# EAGLE design novelkey esp (EAGLE 9.2.2)
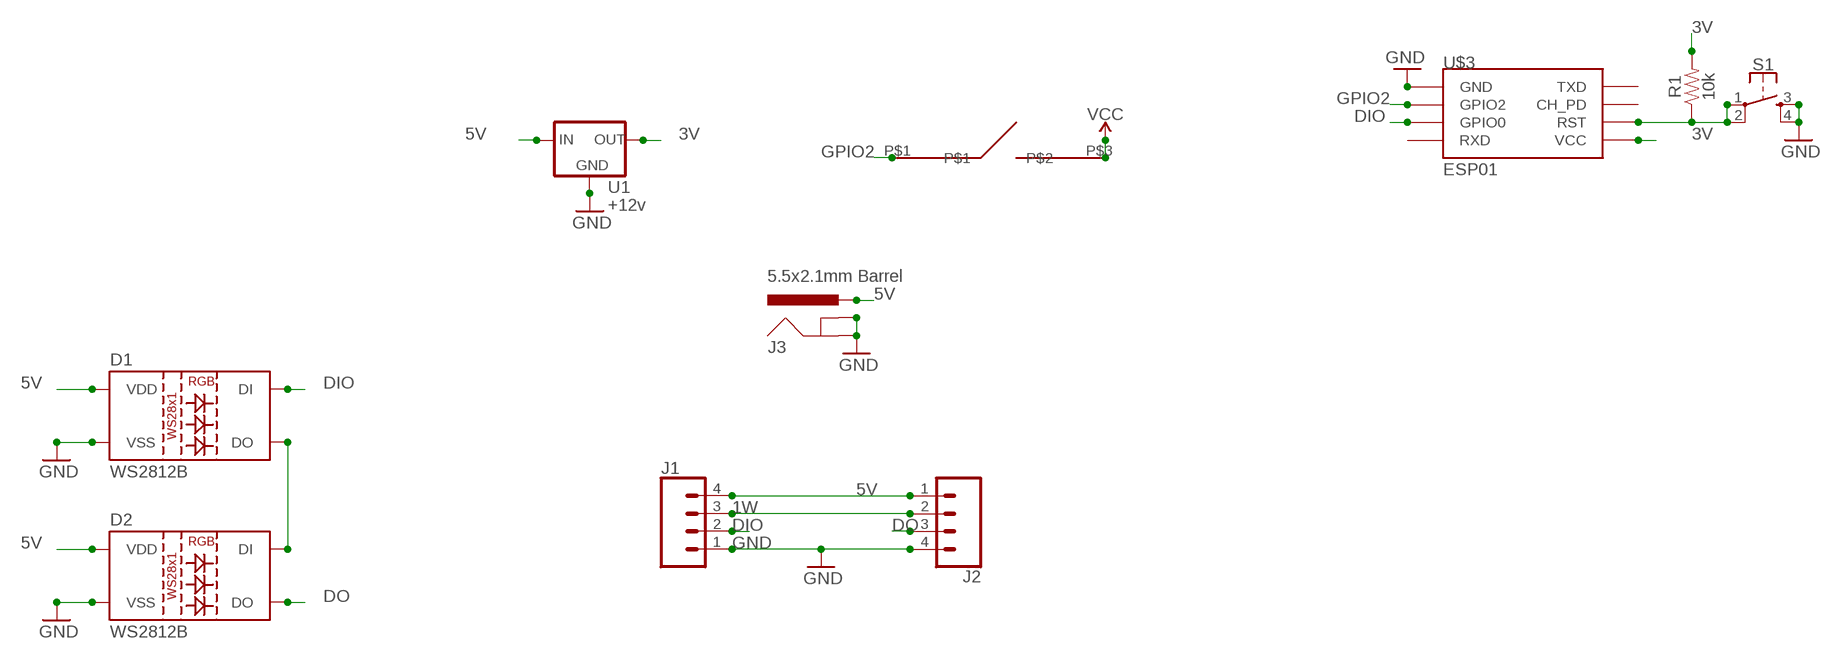
[diagram p0: schematic, sheet 1]

## Parts
D1  WS2812B  [WS2812B]
D2  WS2812B  [WS2812B]
J1  CONN_04SMD2  [1X04_1MM_RA]
J2  CONN_04SMD2  [1X04_1MM_RA]
J3  5.5x2.1mm Barrel  POWER_JACKSMD  [POWER_JACK_SMD]
R1  10k  10KOHM-0603-1/10W-1%  [0603]
S1  MOMENTARY-SWITCH-SPST-2-SMD-4.6X2.8MM  [TACTILE_SWITCH_SMD_4.6X2.8MM]
U1  +12v  V_REG_78XX7812  [TO-252]
U$1  NOVELKEY  [NOVELKEY]
U$3  ESP01  [ESP01]

## Nets
1W: J1.3 J2.2
3V: R1.2 U1.2(OUT) U$3.VCC
5V: D1.1(VDD) D2.1(VDD) J1.4 J2.1 J3.VIN0(PWR) U1.1(IN)
DIO: D1.4(DI) J1.2 U$3.GPIO0
DO: D2.2(DO) J2.3
GND: D1.3(VSS) D2.3(VSS) J1.1 J2.4 J3.GND(GNDBREAK) J3.P$4(GND) S1.3 S1.4 U1.3(GND) U$3.GND
GPIO2: U$1.P$1 U$3.GPIO2
N$1: R1.1 S1.1 S1.2 U$3.RST
N$11: D1.2(DO) D2.4(DI)
VCC: U$1.P$3
Unconnected: U$3.CH_PD U$3.RX(RXD) U$3.TX(TXD)

## Library data of the parts
D1 D2 = SparkFun-LED:WS2812B: WS2812B SMD addressable RGB LED 5x5mm SMD LED with built-in controller IC. Color: Red/Green/Blue mC Rating: RGB: 390, 660, 180 mcd Forward Voltage: RGB: 2.0, 3.0, 3.0 V Packages:WS2812B SparkFun Products: Blynk Board - ESP8266 <https://www.sparkfun.com/products/13794>; PROD_ID: DIO-12503
J1 J2 = SparkFun-Connectors:CONN_04: Multi connection point. Often used as Generic Header-pin footprint for 0.1 inch spaced/style header connections On any of the 0.1 inch spaced packages, you can populate with these: Break Away Headers - Straight <https://www.sparkfun.com/products/116> (PRT-00116) Break Away Male Headers - Right Angle <https://www.sparkfun.com/products/553> (PRT-00553) Female Headers <https://www.sparkfun.com/products/115> (PRT-00115) Break Away Headers - Machine Pin <https://www.sparkfun.com/products/117> (PRT-00117) Break Away Female Headers - Swiss Machine Pin <https://www.sparkfun.com/products/743> (PRT-00743) For SCREWTERMINALS and SPRING TERMINALS visit here: Screw Terimnals on SparkFun.com <https://www.sparkfun.com/search/results?term=Screw+Terminals> (5mm/3.5mm/2.54mm spacing) This device is also useful as a general connection point to wire up your design to another part of your project. Our various solder wires solder well into these plated through hole pads. Hook-Up Wire - Assortment (Stranded, 22 AWG) <https://www.sparkfun.com/products/11375> (PRT-11375) Hook-Up Wire - Assortment (Solid Core, 22 AWG) <https://www.sparkfun.com/products/11367> (PRT-11367) View the entire wire category on our website here <https://www.sparkfun.com/categories/141> Special notes: Molex polarized connector foot print use with SKU : PRT-08231 with associated crimp pins and housings. 1MM SMD Version SKU: PRT-10208; PROD_ID: CONN-10310; SF_ID: PRT-10208
J3 = SparkFun-Connectors:POWER_JACK: Power Jack Connector This is the standard 5.5mm barrel jack for power. The PTH is the most common, proven, reliable, footprint. The Slot footprint only works if the mill layer is transmitted to the PCB fab house so be warned. Here are the connectors we sell at SparkFun: DC Barrel Power Jack/Connector <https://www.sparkfun.com/products/119> (PRT-00119) DC Barrel Power Jack/Connector (SMD) <https://www.sparkfun.com/products/12748> (PRT-12748) DC Barrel Jack Adapter - Breadboard Compatible <https://www.sparkfun.com/products/10811> (PRT-10811) It is used on this SparkFun product (and many, many others): SparkFun RedBoard - Programmed with Arduino <https://www.sparkfun.com/products/12757> (DEV-12757) Also, if you need a mating power supply or connector, please check these out: Wall Adapter Power Supply - 9VDC 650mA <https://www.sparkfun.com/products/298> (TOL-00298) DC Barrel Jack Adapter - Male <https://www.sparkfun.com/products/10287> (PRT-10287); PROD_ID: CONN-08106; SF_ID: PRT-12748
R1 = SparkFun-Resistors:10KOHM: 10kΩ resistor A resistor is a passive two-terminal electrical component that implements electrical resistance as a circuit element. Resistors act to reduce current flow, and, at the same time, act to lower voltage levels within circuits. - Wikipedia; PROD_ID: RES-00824
S1 = SparkFun-Switches:MOMENTARY-SWITCH-SPST-2: Momentary Switch (Pushbutton) - SPST - Two Circuits Normally-open (NO) SPST momentary switches (buttons, pushbuttons). Schematic symbol includes two switch circuits. Variants SMD-4.6MMX2.8MM - 4.60mm x 2.80mm Tactile Momentary Button Switch - Used on SparkFun SAMD21 Mini Breakout <https://www.sparkfun.com/products/13664> SMD-5.2MM - Mini Pushbutton Switch - SMD <https://www.sparkfun.com/products/8720> - Used on Arduino Pro Mini <https://www.sparkfun.com/products/11114>; PROD_ID: SWCH-13065
U1 = SparkFun-IC-Power:V_REG_78XX: Voltage Regulator Standard 78xx regulator. IGO (Input Ground Output). Spark Fun Electronics SKU : COM-00107; PROD_ID: VREG-12370
U$1 = novelkey:NOVELKEY: Novelkey giant MX key
U$3 = esp8266modules:ESP01: ESP8266 Wifi module 01

## Board
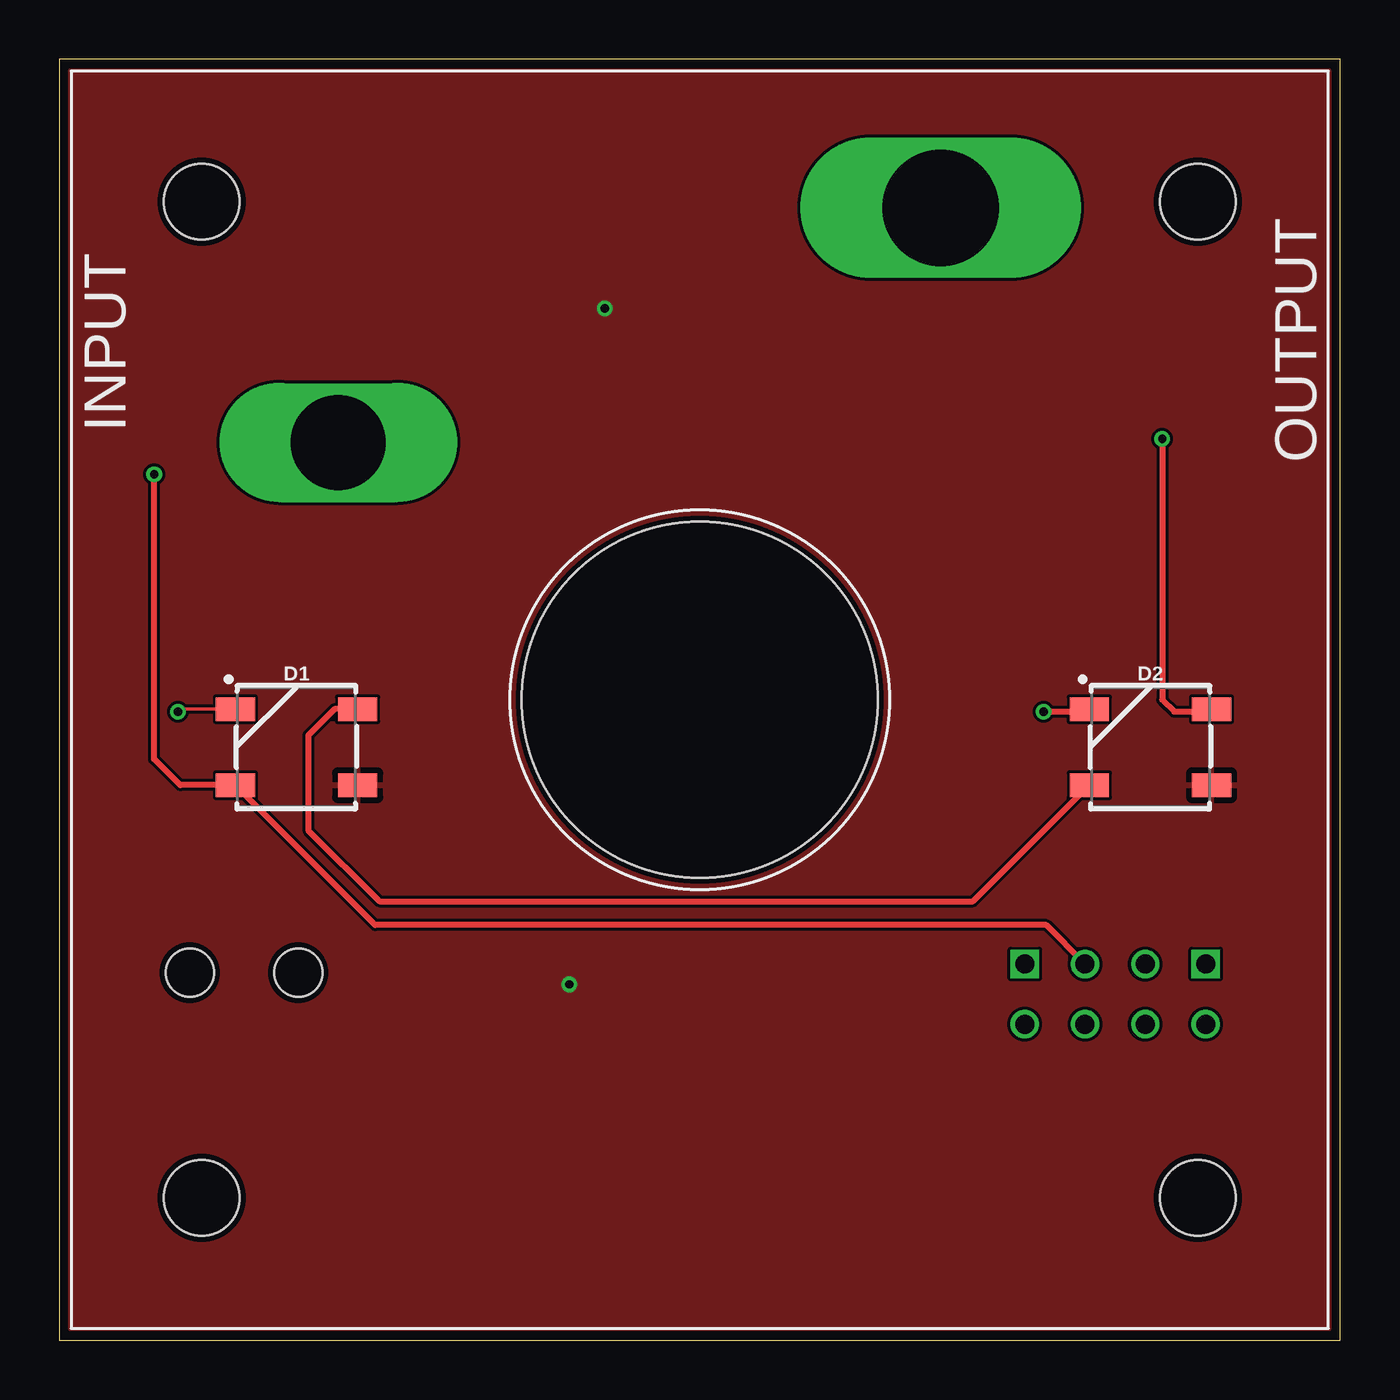
[diagram p1: board, top side]
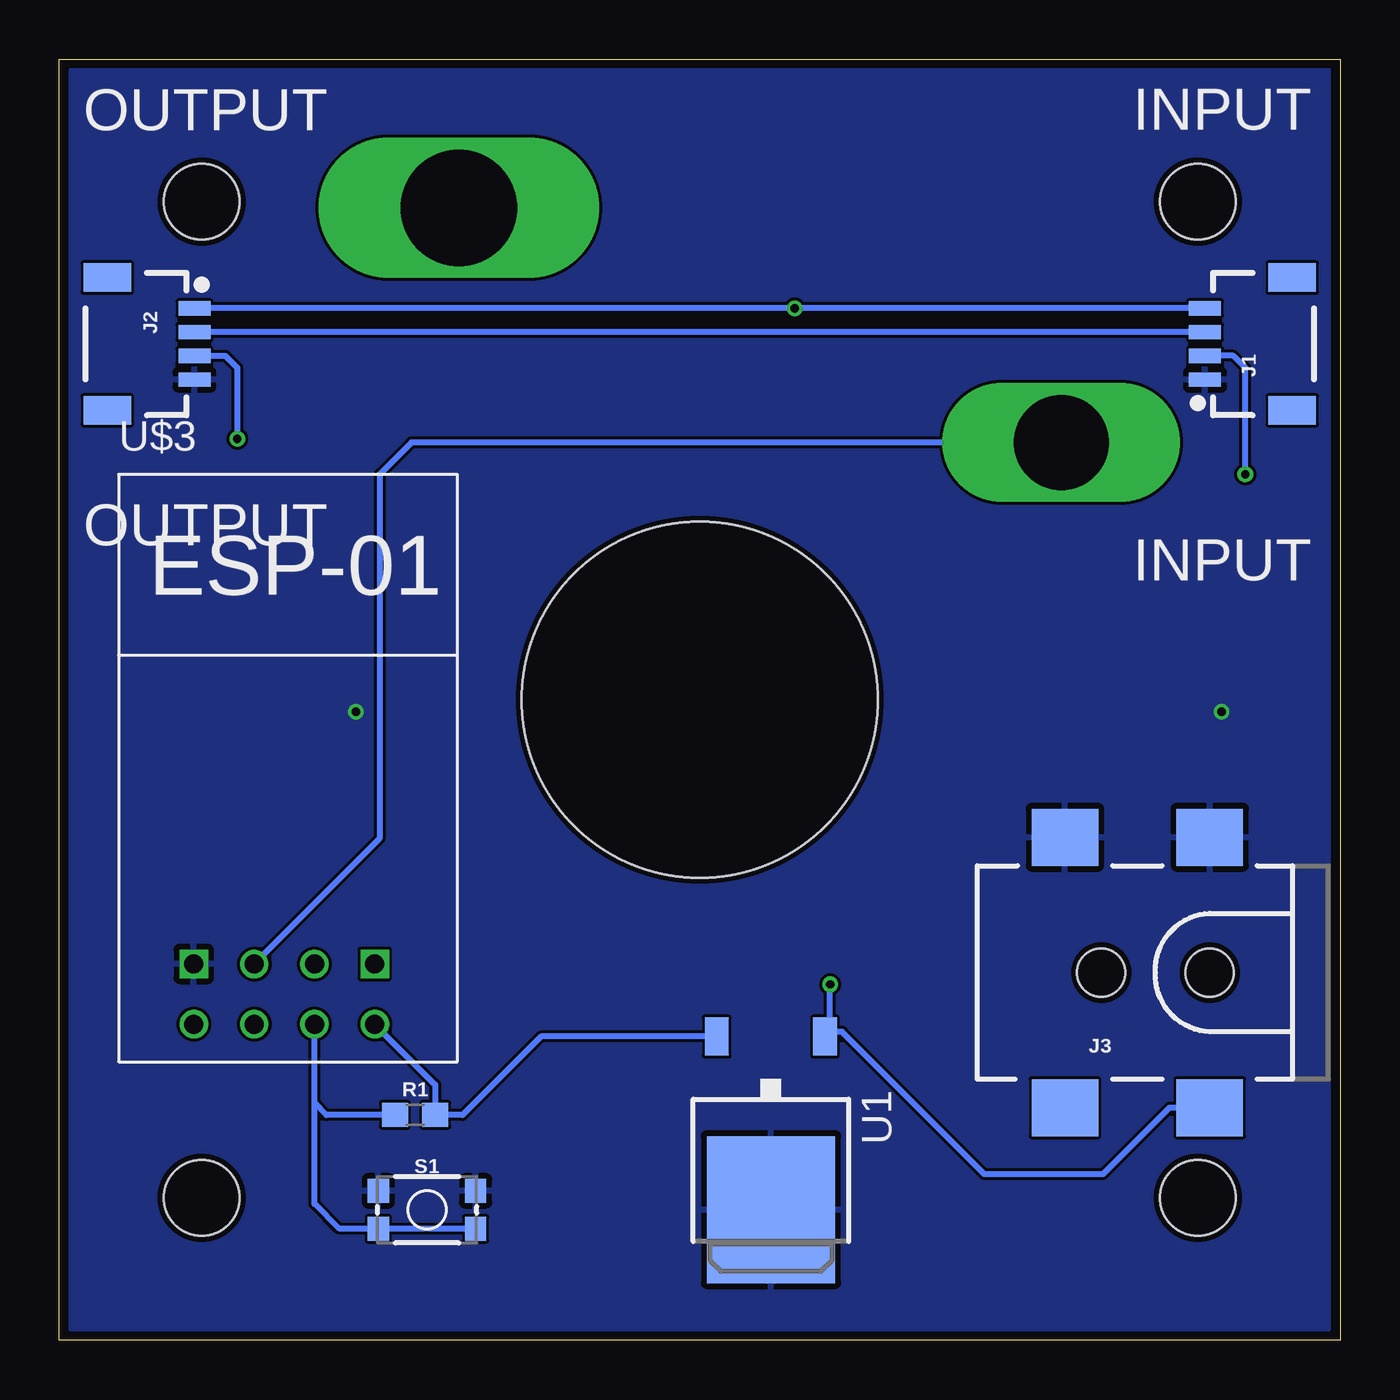
[diagram p2: board, bottom side, seen from below]

Size 54 x 54 mm. Coordinates in mm from the lower left corner, seen from the top.
Outline: 0,0 54,0 54,54 0,54 0,0
Copper layers (1*16): Top 0.035mm / dielectric 1.5mm / Bottom 0.035mm
Design rules "MF_Standard_2_Layer": minimum track width 5mil, minimum drill 12mil, track to track 5mil, track to pad 5mil, pad to pad 5mil, via to via 5mil, smd to smd 0mil, copper to edge 10mil, drill to drill 10mil, minimum pad ring 6mil, minimum via ring 6mil, stop-mask expansion 2mil, vias tented up to drill 25mil, thermal gap 10mil
Holes 3.2 mm at 6,6 48,48 6,48 48,6

### Footprints (pad centres in the part's own frame; a part is rotated, then mirrored left to right if it is on the bottom)
WS2812B = smd 1.651 x 1: 1 2.577,-1.6; 2 2.577,1.6; 3 -2.577,1.6; 4 -2.577,-1.6
1X04_1MM_RA = smd 0.6 x 1.35: 1 -1.5,0; 2 -0.5,0; 3 0.5,0; 4 1.5,0 | smd 1.2 x 2: NC1 2.8,-3.675; NC2 -2.8,-3.675
POWER_JACK_SMD = smd 2.8 x 2.4: GND 0,-5.7; P$4 6.1,-5.7; VIN0 0,5.7; VIN1 6.1,5.7 | hole 2.032: 0,0; 4.572,0
0603 = smd 1.1 x 1: 1 -0.85,0; 2 0.85,0
TACTILE_SWITCH_SMD_4.6X2.8MM = smd 0.9 x 1: 1 -2.05,-0.8; 2 2.05,-0.8; 3 2.05,0.8; 4 -2.05,0.8
TO-252 = smd 1 x 1.6: 1 -2.28,-4.8; 2 2.28,-4.8 | smd 5.4 x 6.2: 3 0,2.5
NOVELKEY = drill 4 pad 5 long: P$1 -15.24,10.85 | drill 4.9 pad 5.8 long: P$3 10.16,20.74 | hole 15: 0,0
ESP01 = drill 0.8: CH_PD -1.285,-8.178; GPIO0 1.255,-5.638; GPIO2 -1.285,-5.638; RST 1.255,-8.178; TX -3.825,-8.178; VCC 3.795,-8.178 | drill 0.8 square: GND -3.825,-5.638; RX 3.795,-5.638

### Placement (x,y rotation side)
D1  10,25 0 top
D2  46,25 0 top
J1  5.7,42 90 bottom
J2  48.3,42 270 bottom
J3  5.5,15.5 180 bottom
R1  39,9.5 0 bottom
S1  38.5,5.5 0 bottom
U1  24,8 180 bottom
U$1  27,27 0 top
U$3  44.5,21.5 0 bottom

### Tracks (layer width: path | path; a pad name or v marks a point on that pad's centre or on a via)
1W
  Bottom 0.254: J1.3 J2.2
3V
  Bottom 0.254: U$3.VCC 38.15,10.77 R1.2 37,9.5 33.7,12.8 U1.2
5V  (via drill 0.35)
  Bottom 0.254: J3.VIN0 7.2,9.8 10,7 15,7 21,13 21.52,13 | 21.52,13 U1.1 | 21.52,13 21.52,14.98 v21.5,15 | J1.4 v23,43.5 J2.1
  pour Top: 0.5,53.5 53.5,53.5 53.5,0.5 0.5,0.5
DIO  (via drill 0.35)
  Top 0.254: U$3.GPIO0 41.61,17.5 13.32,17.5 D1.4 5.1,23.4 4,24.5 v4,36.5
  Bottom 0.254: v4,36.5 4,41 4.5,41.5 J1.2
DO  (via drill 0.35)
  Top 0.254: v46.5,38 46.5,27 47,26.5 48.48,26.5 D2.2
  Bottom 0.254: J2.3 47,41.5 46.5,41 v46.5,38
GND  (via drill 0.35)
  Top 0.152: D1.3 5.1,26.6 v5,26.5
  Top 0.254: v41.5,26.5 43.32,26.5 D2.3
  pour Bottom: 0.5,53.5 53.5,53.5 53.5,0.5 0.5,0.5
GPIO2
  Bottom 0.254: U$1.P$1 39.15,37.85 40.5,36.5 40.5,21.15 U$3.GPIO2
N$1
  Bottom 0.254: 43.24,10 43.24,5.75 42.2,4.7 S1.1 S1.2 | 43.24,10 U$3.RST | R1.1 42.74,9.5 43.24,10
N$11
  Top 0.254: D1.2 11.6,26.6 10.5,25.5 10.5,21.5 13.5,18.5 38.52,18.5 D2.4

### Text on the board
tNames: INPUT | OUTPUT
bNames: INPUT | OUTPUT | INPUT | OUTPUT